# Altium schematic sheet SH3 - RS-485.SchDoc: RS-485 Transceiver
size B; CheckedBy: Wolfgang Windholtz; Engineer: Sahil Kale; Revision: 1; SheetNumber: 3; SheetTotal: 6
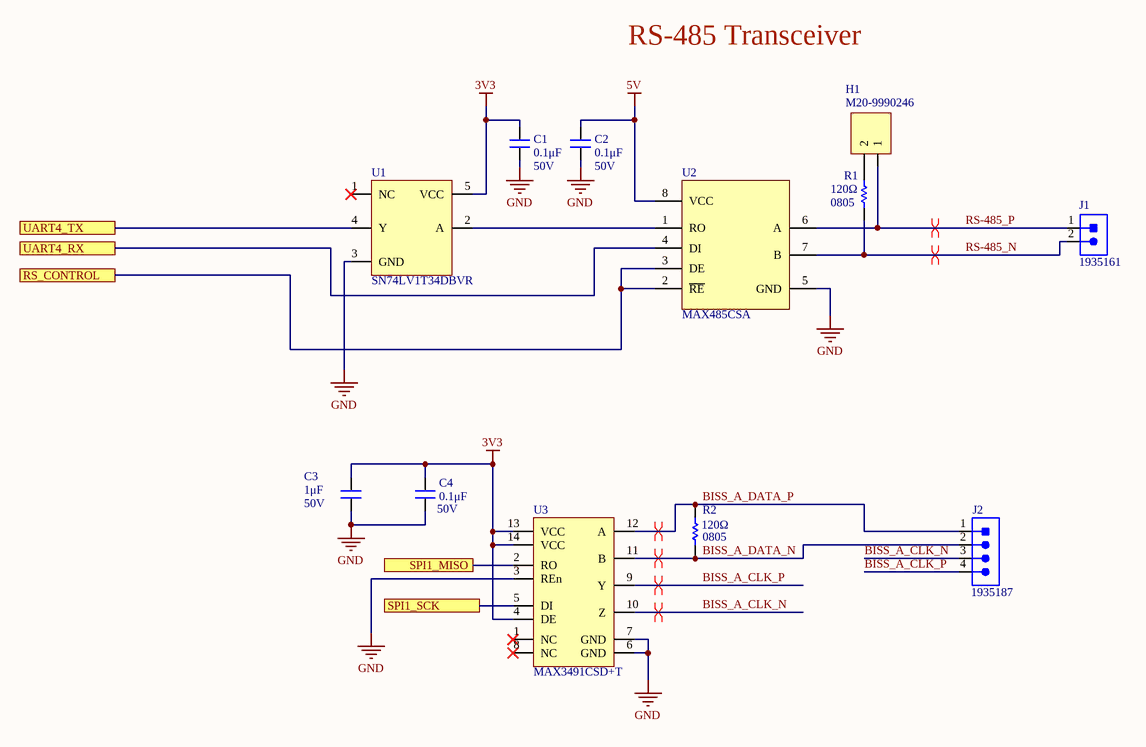
[diagram p0: SH3 - RS-485.SchDoc]

## Parts
C1  value 0.1μF  Voltage Rating: 50V  [CAP2012]  (hidden comment: CAP_0.1uF_50V_0805)
C2  value 0.1μF  Voltage Rating: 50V  [CAP2012]  (hidden comment: CAP_0.1uF_50V_0805)
C3  value 1μF  Voltage Rating: 50V  [CAP2012]  (hidden comment: CAP_1uF_50V_0805)
C4  value 0.1μF  Voltage Rating: 50V  [CAP2012]  (hidden comment: CAP_0.1uF_50V_0805)
H1  Manufacturer Part Number 1: M20-9990246  [HDR1X2]  (hidden comment: JUMPER)
J1  CON_2POS_SCREW_TERM  [1935161]  (value not drawn)
J2  CON_4POS_SCREW_TERM  [1935187]  (value not drawn)
R1  value 120Ω  Package/Footprint: 0805  [RESC0805]  (hidden comment: RES_120Ω_0805_1%)
R2  value 120Ω  Package/Footprint: 0805  [RESC0805]  (hidden comment: RES_120Ω_0805_1%)
U1  IC_BUFFER  [SN74LV1T34DBVR]  (value not drawn)
U2  MAX485CSA  [SOIC127P600X175-8N]
U3  MAX3491  [MAX3491CSD+T]  (value not drawn)

## Ports
RS_CONTROL, SPI1_MISO, SPI1_SCK, UART4_RX, UART4_TX

## Nets
3V3: C1.1 C3.2 C4.2 U1.5(VCC) U3.4(DE) U3.13(VCC) U3.14(VCC)
5V: C2.1 U2.8(VCC)
GND: C1.2 C2.2 C3.1 C4.1 U1.3(GND) U2.5(GND) U3.3(REn) U3.6(GND) U3.7(GND)
BISS_A_CLK_N: J2.3 U3.10(Z)
BISS_A_CLK_P: J2.4 U3.9(Y)
BISS_A_DATA_N: J2.2 R2.1 U3.11(B)
BISS_A_DATA_P: J2.1 R2.2 U3.12(A)
RS-485_N: J1.2 R1.1 U2.7(B)
RS-485_P: H1.1 J1.1 U2.6(A)
RS_CONTROL: U2.2(~{RE}) U2.3(DE) ; port RS_CONTROL
SPI1_MISO: U3.2(RO) ; port SPI1_MISO
SPI1_SCK: U3.5(DI) ; port SPI1_SCK
UART4_RX: U2.4(DI) ; port UART4_RX
UART4_TX: U1.4(Y) ; port UART4_TX
NetH1_2: H1.2 R1.2
NetU1_2: U1.2(A) U2.1(RO)

Not connected (* = marked no-connect by the designer): U1 1(NC)*; U3 1(NC)* 8(NC)*

## Layout directives
differential pair: BISS_A_CLK_N, BISS_A_CLK_P, BISS_A_DATA_N, BISS_A_DATA_P, RS-485_N, RS-485_P

## Notes on the sheet
- RS-485 Transceiver
- Title:
- Project:
- Date:
- Rev:
- Checker:
- Engineer:
- Sheet:
- of

## Library data of the parts
C1 C2 C4 = CAP_0.1uF_50V_0805: CAP CER 0.1UF 50V X7R 0805; Manufacturer Part Number 1: GCM21BR71H104KA37K; Manufacturer 1: Murata Electronics; Package/Footprint: 0805; Supplier Part Number 1: 490-8049-1-ND; Supplier 1: Digi-Key; Dielectric: X7R; Mounting Type: SMD; LCSC Part #: C49678
C3 = CAP_1uF_50V_0805: CAP CER 1UF 50V X7R 0805; Manufacturer 1: Samsung Electro-Mechanics; Manufacturer Part Number 1: CL21B105KBFNNNG; Package/Footprint: 0805; Supplier 1: Digi-Key; Supplier Part Number 1: 1276-6470-1-ND; Mounting Type: SMD; LCSC Part #: C28323
H1 = JUMPER: HEADER 2X1; Manufacturer 1: Harwin Inc.; Package/Footprint: TH; Supplier 1: Digi-Key; Supplier Part Number 1: 952-2262-ND; Mounting Type: TH
J1 = CON_2POS_SCREW_TERM: TERM BLK 2POS SIDE ENTRY 5MM; Manufacturer 1: Phoenix Contact; Package/Footprint: SMD; Supplier 1: Digi-Key; Mounting Type: TH; Supplier Part Number 1: 277-1667-ND; Manufacturer Part Number 1: 1935161
J2 = CON_4POS_SCREW_TERM: TERM BLK 4POS SIDE ENTRY 5MM; Manufacturer 1: Phoenix Contact; Package/Footprint: TH; Wire Gauge: 12-26AWG; Screw Thread: M2.6; Supplier 1: Digi-Key; Mounting Type: TH; Supplier Part Number 1: 277-1579-ND; Manufacturer Part Number 1: 1935187; Pitch: 5mm
R1 R2 = RES_120Ω_0805_1%: RES 120 OHM 1% 1/8W 0805; Manufacturer 1: Vishay; Manufacturer Part Number 1: CRCW0805120RFKEA; Supplier Part Number 1: 541-120CCT-ND; Supplier 1: Digi-Key; Mounting Type: SMD; LCSC Part #: C17437
U1 = IC_BUFFER: IC BUF NON-INVERT 5.5V SOT23-5; Manufacturer 1: Texas Instruments; Package/Footprint: SOT-23-5; Supplier 1: Digi-Key; Supplier Part Number 1: 296-37176-1-ND; Manufacturer Part Number 1: SN74LV1T34DBVR; Mounting Type: SMD; LCSC Part #: C100024
U2 = MAX485CSA: IC RS485 TRANSCEIVER HALF 1/1 8SOIC; Manufacturer 1: Maxim Integrated; Manufacturer Part Number 1: MAX485CSA+T; Protocol: RS422, RS485; Data Rate: 2.5Mbps; Supply Voltage: 4.75V - 5.25V; Package/Footprint: 8-SOIC; Supplier 1: Digi-Key; Supplier Part Number 1: MAX485CSA+TCT-ND; Mounting Type: SMD; LCSC Part #: C9945
U3 = MAX3491: IC RS485 TRANSCEIVER FULL 1/1 14SOIC; Manufacturer 1: Maxim; Package/Footprint: 14-SOIC; Supplier 1: Digi-Key; Supplier Part Number 1: MAX3491CSD+CT-ND; Manufacturer Part Number 1: MAX3491CSD+T; Mounting Type: SMD